# Altium schematic sheet 150120BS75000.SchDoc
size A; SheetNumber: 1; SheetTotal: 1
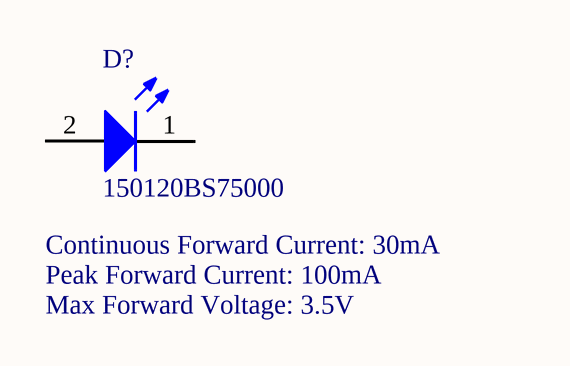
[diagram p0: 150120BS75000.SchDoc]

## Parts
D?  150120BS75000  [WL-SMCW_1206_150120xx75000]

## Nets

Not connected (* = marked no-connect by the designer): D? 1(K) 2(A)

## Notes on the sheet
- (near D?) Continuous Forward Current: 30mA
- Peak Forward Current: 100mA
- Max Forward Voltage: 3.5V

## Library data of the parts
D? = CMP-1426-00015-3: WL-SMCW SMT Mono-Color Chip LED Waterclear; Manufacturer Package Identifier: LED_1206; Dominant Wavelength: 470nm; Lens Style: Clear, Rectangular; Test Current: 20mA; Forward Voltage: 3.2V; Forward Current: 100mA; Peak Wavelength: 465nm; Max Reverse Voltage (DC): 5V; Viewing Angle: 140°; Color: Blue; Luminous Intensity: 145mcd; Max Operating Temperature: 85°C; Case Code (Imperial): 1206; Length: 3.2mm; Width: 1.6mm; Min Operating Temperature: -40°C; Height: 680µm; Case Code (Metric): 3216; Packaging: Tape and Reel; RoHS: Compliant; Case/Package: 1206; REACH SVHC: Unknown; Wavelength: 470nm; Mount: Surface Mount